# EAGLE design facedancer11 (EAGLE 6.1)
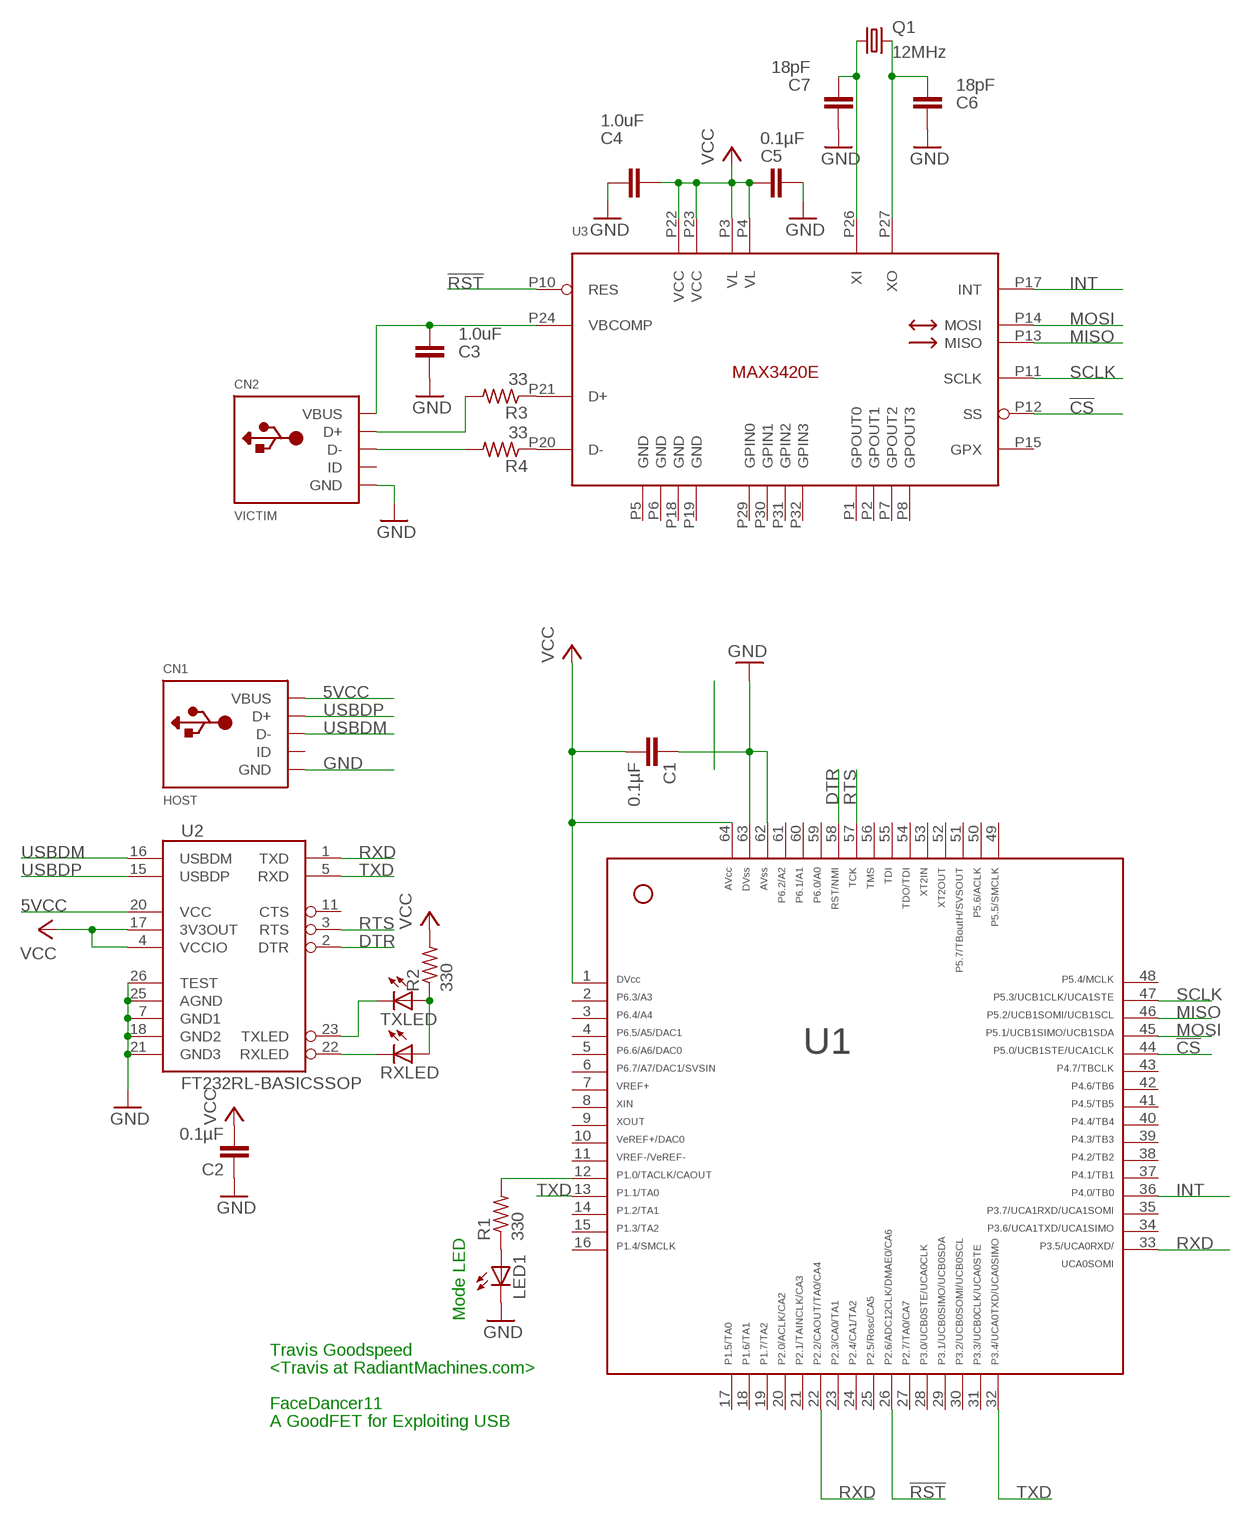
[diagram p0: schematic, sheet 1]

## Parts
C1  0.1µF  C-EUC0603  [C0603]
C2  0.1µF  C-EUC0603  [C0603]
C3  1.0uF  C-EUC0603  [C0603]
C4  1.0uF  C-EUC0603  [C0603]
C5  0.1µF  C-EUC0603  [C0603]
C6  18pF  C-EUC0603  [C0603]
C7  18pF  C-EUC0603  [C0603]
CN1  HOST  USBMINIB  [USB-MINIB]
CN2  VICTIM  USBMINIB  [USB-MINIB]
LED1  LEDCHIP-LED0603  [CHIP-LED0603]
Q1  12MHz  CRYSTALHC49UP  [HC49UP]
R1  330  R-US_R0603  [R0603]
R2  330  R-US_R0603  [R0603]
R3  33  R-US_R0603  [R0603]
R4  33  R-US_R0603  [R0603]
RXLED  LEDCHIP-LED0603  [CHIP-LED0603]
TXLED  LEDCHIP-LED0603  [CHIP-LED0603]
U1  F261X---PM64  [PM/PAG64]
U2  FT232RL-BASICSSOP  [SSOP28DB]
U3  MAX3420ELQFP32  [LQFP32]

## Nets
5VCC: CN1.VBUS U2.20(VCC)
!CS: U1.44 U3.P12(SS)
!RST: U1.26 U3.P10(RES)
DTR: U1.58 U2.2(DTR)
GND: C1.1 C2.1 C3.1 C4.1 C5.1 C6.1 C7.1 CN1.GND CN2.GND LED1.C U1.62 U1.63 U2.7(GND1) U2.18(GND2) U2.21(GND3) U2.25(AGND) U2.26(TEST)
INT: U1.36 U3.P17(INT)
MISO: U1.46 U3.P13(MISO)
MOSI: U1.45 U3.P14(MOSI)
N$1: R1.2 U1.12
N$2: LED1.A R1.1
N$3: C7.2 Q1.1 U3.P26(XI)
N$4: C6.2 Q1.2 U3.P27(XO)
N$5: R3.1 U3.P21(D+)
N$6: RXLED.C U2.22(RXLED)
N$7: TXLED.C U2.23(TXLED)
N$8: R2.1 RXLED.A TXLED.A
N$9: R4.1 U3.P20(D-)
N$10: CN2.D- R4.2
N$11: CN2.D+ R3.2
RTS: U1.57 U2.3(RTS)
RXD: U1.22 U1.33 U2.1(TXD)
SCLK: U1.47 U3.P11(SCLK)
TXD: U1.13 U1.32 U2.5(RXD)
USBDM: CN1.D- U2.16(USBDM)
USBDP: CN1.D+ U2.15(USBDP)
VBCOMP: C3.2 CN2.VBUS U3.P24(VBCOMP)
VCC: C1.2 C2.2 C4.2 C5.2 R2.2 U1.1 U1.64 U2.4(VCCIO) U2.17(3V3OUT) U3.P3(VL) U3.P4(VL) U3.P22(VCC) U3.P23(VCC)
Unconnected: CN1.ID CN2.ID U1.2 U1.3 U1.4 U1.5 U1.6 U1.7 U1.8 U1.9 U1.10 U1.11 U1.14 U1.15 U1.16 U1.17 U1.18 U1.19 U1.20 U1.21 U1.23 U1.24 U1.25 U1.27 U1.28 U1.29 U1.30 U1.31 U1.34 U1.35 U1.37 U1.38 U1.39 U1.40 U1.41 U1.42 U1.43 U1.48 U1.49 U1.50 U1.51 U1.52 U1.53 U1.54 U1.55 U1.56 U1.59 U1.60 U1.61 U2.11(CTS) U3.P1(GPOUT0) U3.P2(GPOUT1) U3.P7(GPOUT2) U3.P8(GPOUT3) U3.P15(GPX) U3.P29(GPIN0) U3.P30(GPIN1) U3.P31(GPIN2) U3.P32(GPIN3)

## Notes on the sheet
- Mode LED
- Travis Goodspeed
- <Travis at RadiantMachines.com>
- FaceDancer11
- A GoodFET for Exploiting USB

## Power pins joined to a net without a drawn wire
GND: U3.P5(GND) U3.P6(GND) U3.P18(GND) U3.P19(GND)

## Library data of the parts
C1-C7 = rcl:C-EU: CAPACITOR, European symbol
CN1 CN2 = adafruit:USB: USB Connectors USBMINIB - Surface Mount Female Mini-B USB Connector 4UConnector: 06564 By microbuilder.eu Thru-hole RA Female Mini-B USB Connector 4UConnector: 18732 By ladyada.net
LED1 RXLED TXLED = led:LED: LED OSRAM: - CHIPLED LG R971, LG N971, LY N971, LG Q971, LY Q971, LO R971, LY R971 LH N974, LH R974 LS Q976, LO Q976, LY Q976 LO Q996 - Hyper CHIPLED LW Q18S LB Q993, LB Q99A, LB R99A - SideLED LS A670, LO A670, LY A670, LG A670, LP A670 LB A673, LV A673, LT A673, LW A673 LH A674 LY A675 LS A676, LA A676, LO A676, LY A676, LW A676 LS A679, LY A679, LG A679 - Hyper Micro SIDELED® LS Y876, LA Y876, LO Y876, LY Y876 LT Y87S - SmartLED LW L88C, LW L88S LB L89C, LB L89S, LG L890 LS L89K, LO L89K, LY L89K LS L896, LA L896, LO L896, LY L896 - TOPLED LS T670, LO T670, LY T670, LG T670, LP T670 LSG T670, LSP T670, LSY T670, LOP T670, LYG T670 LG T671, LOG T671, LSG T671 LB T673, LV T673, LT T673, LW T673 LH T674 LS T676, LA T676, LO T676, LY T676, LB T676, LH T676, LSB T676, LW T676 LB T67C, LV T67C, LT T67C, LS T67K, LO T67K, LY T67K, LW E67C LS E67B, LA E67B, LO E67B, LY E67B, LB E67C, LV E67C, LT E67C LW T67C LS T679, LY T679, LG T679 LS T770, LO T770, LY T770, LG T770, LP T770 LB T773, LV T773, LT T773, LW T773 LH T774 LS E675, LA E675, LY E675, LS T675 LS T776, LA T776, LO T776, LY T776, LB T776 LHGB T686 LT T68C, LB T68C - Hyper Mini TOPLED® LB M676 - Mini TOPLED Santana® LG M470 LS M47K, LO M47K, LY M47K Source: http://www.osram.convergy.de LUXEON: - LUMILED® LXK2-PW12-R00, LXK2-PW12-S00, LXK2-PW14-U00, LXK2-PW14-V00 LXK2-PM12-R00, LXK2-PM12-S00, LXK2-PM14-U00 LXK2-PE12-Q00, LXK2-PE12-R00, LXK2-PE12-S00, LXK2-PE14-T00, LXK2-PE14-U00 LXK2-PB12-K00, LXK2-PB12-L00, LXK2-PB12-M00, LXK2-PB14-N00, LXK2-PB14-P00, LXK2-PB14-Q00 LXK2-PR12-L00, LXK2-PR12-M00, LXK2-PR14-Q00, LXK2-PR14-R00 LXK2-PD12-Q00, LXK2-PD12-R00, LXK2-PD12-S00 LXK2-PH12-R00, LXK2-PH12-S00 LXK2-PL12-P00, LXK2-PL12-Q00, LXK2-PL12-R00 Source: www.luxeon.com KINGBRIGHT: KA-3528ASYC Source: www.kingbright.com
Q1 = crystal:CRYSTAL: CRYSTAL; OC_FARNELL: unknown; OC_NEWARK: unknown
R1-R4 = rcl:R-US_: RESISTOR, American symbol
U1 = TI_MSP430_v13:F261X---PM64: ***MSP430F261x***PM64
U2 = SparkFun:FT232RL-BASIC: USB UART This is the simplified version of the FT232RL unit. Only what you need, nothing you don't. Spark Fun Electronics SKU : COM-00650
U3 = active:MAX3420E

## Board
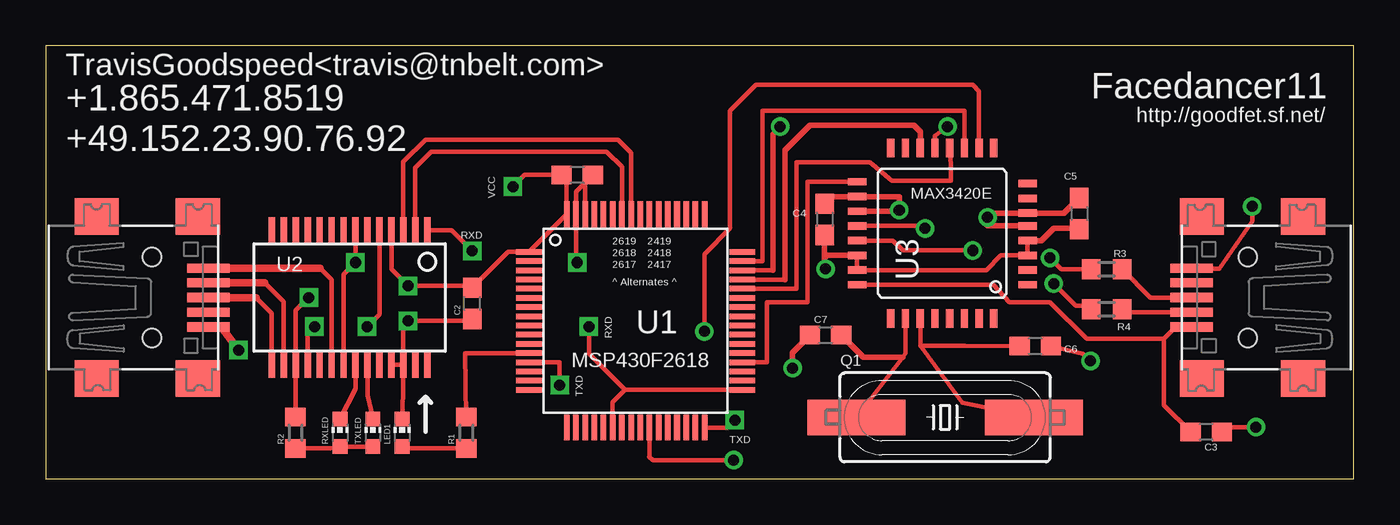
[diagram p1: board, top side]
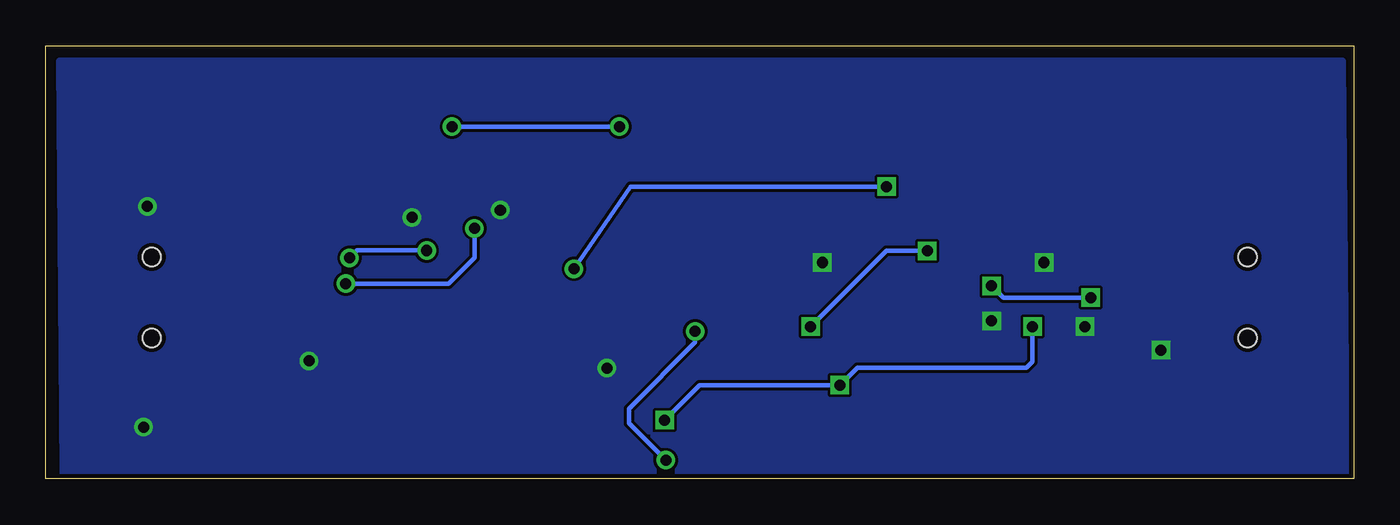
[diagram p2: board, bottom side, seen from below]

Size 71.11 x 23.52 mm. Coordinates in mm from the lower left corner, seen from the top.
Outline: 0,0 71.11,0 71.11,23.52 0,23.52 0,0
Copper layers (1*16): Top 0.035mm / dielectric 1.5mm / Bottom 0.035mm
Design rules: minimum track width 10mil, minimum drill 8mil, track to track 6mil, track to pad 6mil, pad to pad 6mil, via to via 6mil, smd to smd 6mil, copper to edge 10mil, drill to drill 8mil, minimum pad ring 10mil, minimum via ring 8mil, stop-mask expansion 4mil, vias tented up to drill 0mil, thermal gap 10mil

### Footprints (pad centres in the part's own frame; a part is rotated, then mirrored left to right if it is on the bottom)
C0603 = smd 1.1 x 1: 1 -0.85,0; 2 0.85,0
USB-MINIB = smd 0.5 x 2.308: D+ 0,4.064; D- -0.8,4.064; GND 1.6,4.064; ID 0.8,4.064; VBUS -1.6,4.064 | smd 2 x 2.4: GND1 -4.4,-2; GND2 -4.4,3.5; GND3 4.4,3.5; GND4 4.4,-2 | hole 1: -2.2,1; 2.2,1
CHIP-LED0603 = smd 0.8 x 0.8: A 0,-0.75; C 0,0.75
HC49UP = smd 5.334 x 1.93: 1 -4.826,0; 2 4.826,0
R0603 = smd 1 x 1.1: 1 -0.85,0; 2 0.85,0
PM/PAG64 = smd 1.4 x 0.3: 1 -5.8,3.75; 2 -5.8,3.25; 3 -5.8,2.75; 4 -5.8,2.25; 5 -5.8,1.75; 6 -5.8,1.25; 7 -5.8,0.75; 8 -5.8,0.25; 9 -5.8,-0.25; 10 -5.8,-0.75; 11 -5.8,-1.25; 12 -5.8,-1.75; 13 -5.8,-2.25; 14 -5.8,-2.75; 15 -5.8,-3.25; 16 -5.8,-3.75; 33 5.8,-3.75; 34 5.8,-3.25; 35 5.8,-2.75; 36 5.8,-2.25; 37 5.8,-1.75; 38 5.8,-1.25; 39 5.8,-0.75; 40 5.8,-0.25; 41 5.8,0.25; 42 5.8,0.75; 43 5.8,1.25; 44 5.8,1.75; 45 5.8,2.25; 46 5.8,2.75; 47 5.8,3.25; 48 5.8,3.75 | smd 0.3 x 1.4: 17 -3.75,-5.8; 18 -3.25,-5.8; 19 -2.75,-5.8; 20 -2.25,-5.8; 21 -1.75,-5.8; 22 -1.25,-5.8; 23 -0.75,-5.8; 24 -0.25,-5.8; 25 0.25,-5.8; 26 0.75,-5.8; 27 1.25,-5.8; 28 1.75,-5.8; 29 2.25,-5.8; 30 2.75,-5.8; 31 3.25,-5.8; 32 3.75,-5.8; 49 3.75,5.8; 50 3.25,5.8; 51 2.75,5.8; 52 2.25,5.8; 53 1.75,5.8; 54 1.25,5.8; 55 0.75,5.8; 56 0.25,5.8; 57 -0.25,5.8; 58 -0.75,5.8; 59 -1.25,5.8; 60 -1.75,5.8; 61 -2.25,5.8; 62 -2.75,5.8; 63 -3.25,5.8; 64 -3.75,5.8
SSOP28DB = smd 0.348 x 1.397: 1 -4.225,-3.656; 2 -3.575,-3.656; 3 -2.925,-3.656; 4 -2.275,-3.656; 5 -1.625,-3.656; 6 -0.975,-3.656; 7 -0.325,-3.656; 8 0.325,-3.656; 9 0.975,-3.656; 10 1.625,-3.656; 11 2.275,-3.656; 12 2.925,-3.656; 13 3.575,-3.656; 14 4.225,-3.656; 15 4.225,3.656; 16 3.575,3.656; 17 2.925,3.656; 18 2.275,3.656; 19 1.625,3.656; 20 0.975,3.656; 21 0.325,3.656; 22 -0.325,3.656; 23 -0.975,3.656; 24 -1.625,3.656; 25 -2.275,3.656; 26 -2.925,3.656; 27 -3.575,3.656; 28 -4.225,3.656
LQFP32 = smd 0.4 x 1: P1 -2.8,-4.635; P2 -2,-4.635; P3 -1.2,-4.635; P4 -0.4,-4.635; P5 0.4,-4.635; P6 1.1,-4.635; P7 1.9,-4.635; P8 2.7,-4.635; P17 2.8,4.635; P18 2,4.635; P19 1.2,4.635; P20 0.4,4.635; P21 -0.4,4.635; P22 -1.2,4.635; P23 -2,4.635; P24 -2.8,4.635 | smd 1 x 0.4: P9 4.635,-2.8; P10 4.635,-2; P11 4.635,-1.2; P12 4.635,-0.4; P13 4.635,0.4; P14 4.635,1.2; P15 4.635,2; P16 4.635,2.8; P25 -4.635,2.8; P26 -4.635,2; P27 -4.635,1.2; P28 -4.635,0.4; P29 -4.635,-0.4; P30 -4.635,-1.2; P31 -4.635,-2; P32 -4.635,-2.8

### Placement (x,y rotation side)
C1  28.89,16.51 180 top
C2  23.18,9.53 90 top
C3  63.1,2.54 180 top
C4  42.34,14.1 270 top
C5  56.19,14.4 270 top
C6  53.8,7.2 180 top
C7  42.4,7.8 0 top
CN1  4.76,9.84 270 top
CN2  TARGET  [USB-MINIB]  66.36,9.84 90 top
LED1  19.37,2.49 0 top
Q1  48.9,3.33 0 top
R1  22.86,2.49 90 top
R2  13.57,2.49 90 top
R3  57.68,11.38 0 top
R4  57.68,9.21 0 top
RXLED  15.99,2.49 0 top
TXLED  17.78,2.49 0 top
U1  32.07,8.57 0 top
U2  16.51,9.84 180 top
U3  48.74,13.34 90 top

### Tracks (layer width: path | path; a pad name or v marks a point on that pad's centre or on a via)
5VCC
  Top 0.254: U2.20 15.54,10.82 14.91,11.44
  Top 0.406: CN1.VBUS 14.91,11.44
!CS
  Top 0.254: U3.P12 49.2,17.08 49.2,16.2 46,16.2 44.8,17.2 40.8,17.2 40.8,10.32 U1.44
!RST  (via drill 0.6)
  Top 0.254: U3.P10 50.74,21.06 50.4,21.4 38.6,21.4 37.2,20 37.2,13.6 35.8,12.2 v35.8,8 | v37.4,1 33,1 32.8,1.2 32.82,1.22 U1.26
  Bottom 0.254: v35.8,8 35.8,7.4 39.4,3.8 39.4,3 v37.4,1
DTR
  Top 0.254: U2.2 20.09,16.91 20.95,17.78 30.48,17.78 31.32,16.94 U1.58
GND  (via drill 0.6)
  Top 0.254: U2.26 U2.25 | U2.26 19.43,8.32 v19.68,8.57 23.28,8.57 C2.1 | U2.18 14.23,8.2 v14.61,8.26 | U2.7 16.84,13.34 16.83,13.34 v16.83,11.75 16.18,11.11 U2.21 | U2.26 19.43,4.63 LED1.C | U1.62 29.32,16.09 C1.1 28.82,15.59 U1.63 28.82,11.82 v28.89,11.75 | 51.44,14.44 v51.2,14.2 | CN2.GND 62.73,11.4 63.8,11.4 65.6,14 v65.6,14.8 | C3.1 64.21,2.8 v65.8,2.8 | C6.1 56.4,6.8 v56.8,6.4
  Top 0.305: C4.1 42.74,15.34 U3.P18 46.4,15.34 v46.4,14.6 46.4,14.54 U3.P19 | U3.P5 51.2,13.73 v51.2,14.2 51.2,14.44 U3.P6 55.37,14.44 C5.1 | C7.1 40.6,6.85 v40.6,6
  Top 0.406: CN1.GND 9.54,8.24 v10.48,6.99
  pour Bottom: 0.41,0.32 70.17,0.32 70.37,22.68 0.61,22.68
INT
  Top 0.254: U3.P17 41.4,16.14 41.4,9.6 39.2,9.6 39.2,6.32 U1.36
MISO  (via drill 0.6)
  Top 0.254: U1.46 39.52,11.32 | U3.P13 48.34,18.65 v49.02,19.13
  Top 0.305: 39.52,11.32 39.52,18.73 v39.92,19.13
  Bottom 0.254: v39.92,19.13 v49.02,19.13
MOSI
  Top 0.254: U1.45 40.19,10.82 | 47.54,18.45 U3.P14
  Top 0.305: 40.19,10.82 40.19,17.84 41.55,19.2 47.2,19.2 47.54,18.86 47.54,18.45
N$1
  Top 0.254: U1.12 22.79,6.82 R1.2
N$2
  Top 0.254: R1.1 19.57,1.64 LED1.A
N$3
  Top 0.254: U3.P26 46.74,6.8 46.59,6.61 Q1.1
  Top 0.305: C7.2 44.44,6.61 46.59,6.61
N$4
  Top 0.254: U3.P27 47.54,7.23 | 47.54,7.23 49.85,4.13 Q1.2 | 47.54,7.23 49.98,7.23 C6.2
N$5  (via drill 0.6)
  Top 0.254: U3.P21 46.06,12.94 46.6,12.4 v50.4,12.4 | R3.1 55.22,11.38 v54.6,12
  Bottom 0.254: v50.4,12.4 54.2,12.4 v54.6,12
N$6
  Top 0.254: U2.22 16.84,4.88 RXLED.C
N$7
  Top 0.254: U2.23 17.48,4.54 TXLED.C
N$8
  Top 0.254: R2.1 15.49,1.64 RXLED.A TXLED.A
N$9  (via drill 0.6)
  Top 0.254: U3.P20 47.66,13.73 v47.8,13.6 | R4.1 56.83,9.37 56.8,9.4 56,9.4 v54.8,10.6
  Bottom 0.254: v47.8,13.6 47.8,12 49.2,10.6 v54.8,10.6
N$10
  Top 0.254: 58.53,9.36 R4.2 58.6,9.2 58.76,9.04 CN2.D-
N$11
  Top 0.254: CN2.D+ 60.07,9.84 R3.2
RTS
  Top 0.254: U2.3 19.43,17.21 20.64,18.41 31.11,18.41 31.82,17.71 U1.57
RXD  (via drill 0.6)
  Top 0.254: 31.49,4.82 U1.33 | U1.22 30.82,4.15 31.49,4.82 | U2.1 22.06,13.5 v23.18,12.38 | v29.53,8.26 29.53,6.79 31.49,4.82
  Bottom 0.254: v23.18,12.38 25.4,12.38 v29.53,8.26
SCLK
  Top 0.254: U1.47 38.97,11.82 38.97,20 49.94,20 U3.P11
TXD  (via drill 0.6)
  Top 0.254: U2.5 18.14,8.93 v17.46,8.26 | U1.32 37.06,2.77 v37.47,3.17 | U1.13 27.94,6.32 v27.94,5.08
  Bottom 0.254: v17.46,8.26 17.46,6.35 17.78,6.03 26.99,6.03 v27.94,5.08 35.56,5.08 v37.47,3.17
USBDM
  Top 0.254: U2.16 12.94,9.61 11.9,10.64
  Top 0.406: CN1.D- 11.9,10.64
USBDP
  Top 0.254: U2.15 12.29,8.99 11.43,9.84
  Top 0.406: CN1.D+ 11.43,9.84
VBCOMP
  Top 0.254: C3.2 60.8,3.98 60.8,7.6 | 60.8,7.6 56.6,7.6 54.6,9.6 52.4,9.6 51.53,10.54 U3.P24 | CN2.VBUS 61.44,8.24 60.8,7.6
VCC  (via drill 0.6)
  Top 0.254: U2.4 18.79,11.38 v19.68,10.48 23.07,10.48 C2.2 25.12,12.32 U1.1 U1.64 28.32,16.23 C1.2 26.04,16.51 v25.4,15.88 | v14.29,9.84 13.59,9.14 U2.17 13.59,4.73 R2.2 | U3.P4 U3.P3 51.94,12.13 51.13,11.34 U3.P23 U3.P22 43.73,12.13
  Top 0.305: U3.P4 54.13,12.94 54.8,13.6 56.14,13.6 C5.2 | C4.2 42.34,12 | 42.34,12 42.34,11.46 v42.4,11.4 | 43.73,12.13 42.48,12.13 42.34,12
  Bottom 0.254: v14.29,9.84 19.05,9.84 v19.68,10.48 | v25.4,15.88 39.33,15.88 v42.4,11.4

### Text on the board
tNames: TravisGoodspeed<travis@tnbelt.com> | Facedancer11 | +1.865.471.8519 | http://goodfet.sf.net/ | +49.152.23.90.76.92 | VCC | MAX3420E | RXD | 2619 | 2419 | 2618 | 2418 | 2617 | 2417 | ^ Alternates ^ | RXD | MSP430F2618 | TXD | TXD